# Altium schematic sheet EPS_MPPT_X_EMI-Filter_Out.SchDoc: MPPT-X / EMI-Filter / Out
size A4
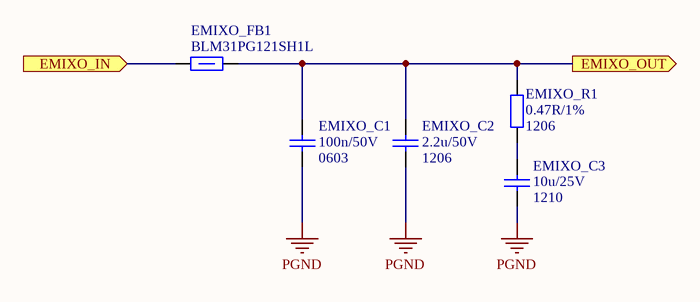
[diagram p0: EPS_MPPT_X_EMI-Filter_Out.SchDoc]

## Parts
EMIXO_C1  Package: 0603  [SMD_Capacitor_0603]  (hidden comment: 100n/50V)
EMIXO_C2  Package: 1206  [SMD_Capacitor_1206]  (hidden comment: 2.2u/50V)
EMIXO_C3  Package: 1210  [SMD_Capacitor_1210]  (hidden comment: 10u/25V)
EMIXO_FB1  120R/100MHz  [SMD_FerriteBead_1206]  (value not drawn)
EMIXO_R1  Package: 1206  [SMD_Resistor_1206]  (hidden comment: 0.47R/1%)

## Ports
EMIXO_IN (in), EMIXO_OUT (out)

## Nets
PGND: EMIXO_C1.2 EMIXO_C2.2 EMIXO_C3.2
EMIXO_IN: EMIXO_FB1.2 ; port EMIXO_IN
EMIXO_OUT: EMIXO_C1.1 EMIXO_C2.1 EMIXO_FB1.1 EMIXO_R1.2 ; port EMIXO_OUT
NetEMIXO_C3_1: EMIXO_C3.1 EMIXO_R1.1

## Notes on the sheet
- Title:
- Project:
- Author:
- Model:
- Document Number:
- Checked by:
- Rev:
- Date:
- Approved by:
- Sheet:
- of
- File name:

## Library data of the parts
EMIXO_C1 = Cer_C0603T104K5RALTU: Ceramic Cap Kemet COTS 100n/50V X7R 0603; Manufacturer: Kemet; ManufacturerPartNumber: C0603T104K5RALTU; Value: 100n/50V
EMIXO_C2 = Cer_GCJ31CR71H225KA12L: Ceramic Cap Murata Automotive 2.2u/50V X7R 1206; Manufacturer: Murata; ManufacturerPartNumber: GCJ31CR71H225KA12L; Value: 2.2u/50V
EMIXO_C3 = Cer_GCJ32ER71E106KA12L: Ceramic Cap Murata Automotive 10u/25V X7R 1210; Manufacturer: Murata; ManufacturerPartNumber: GCJ32ER71E106KA12L; Value: 10u/25V
EMIXO_FB1 = BLM31PG121SH1L: Ferrite bead, 1206, 0.02HM, 3.5A.; Manufacturer: Murata; Current Rating: 3.5A; Series Resistance DC: 0.02R; Package: 1206; Value: 120R/100MHz; ManufacturerPartNumber: BLM31PG121SH1L
EMIXO_R1 = ERJ-8BQFR47V: Panasonic Resistor 0.47R 1% 1206 330mW; ManufacturerPartNumber: ERJ-8BQFR47V; Manufacturer: Panasonic; Value: 0.47R/1%